# EAGLE design Armature_Joint_PCB_V1.1 (EAGLE 9.6.2)

## Sheet 1 of 3
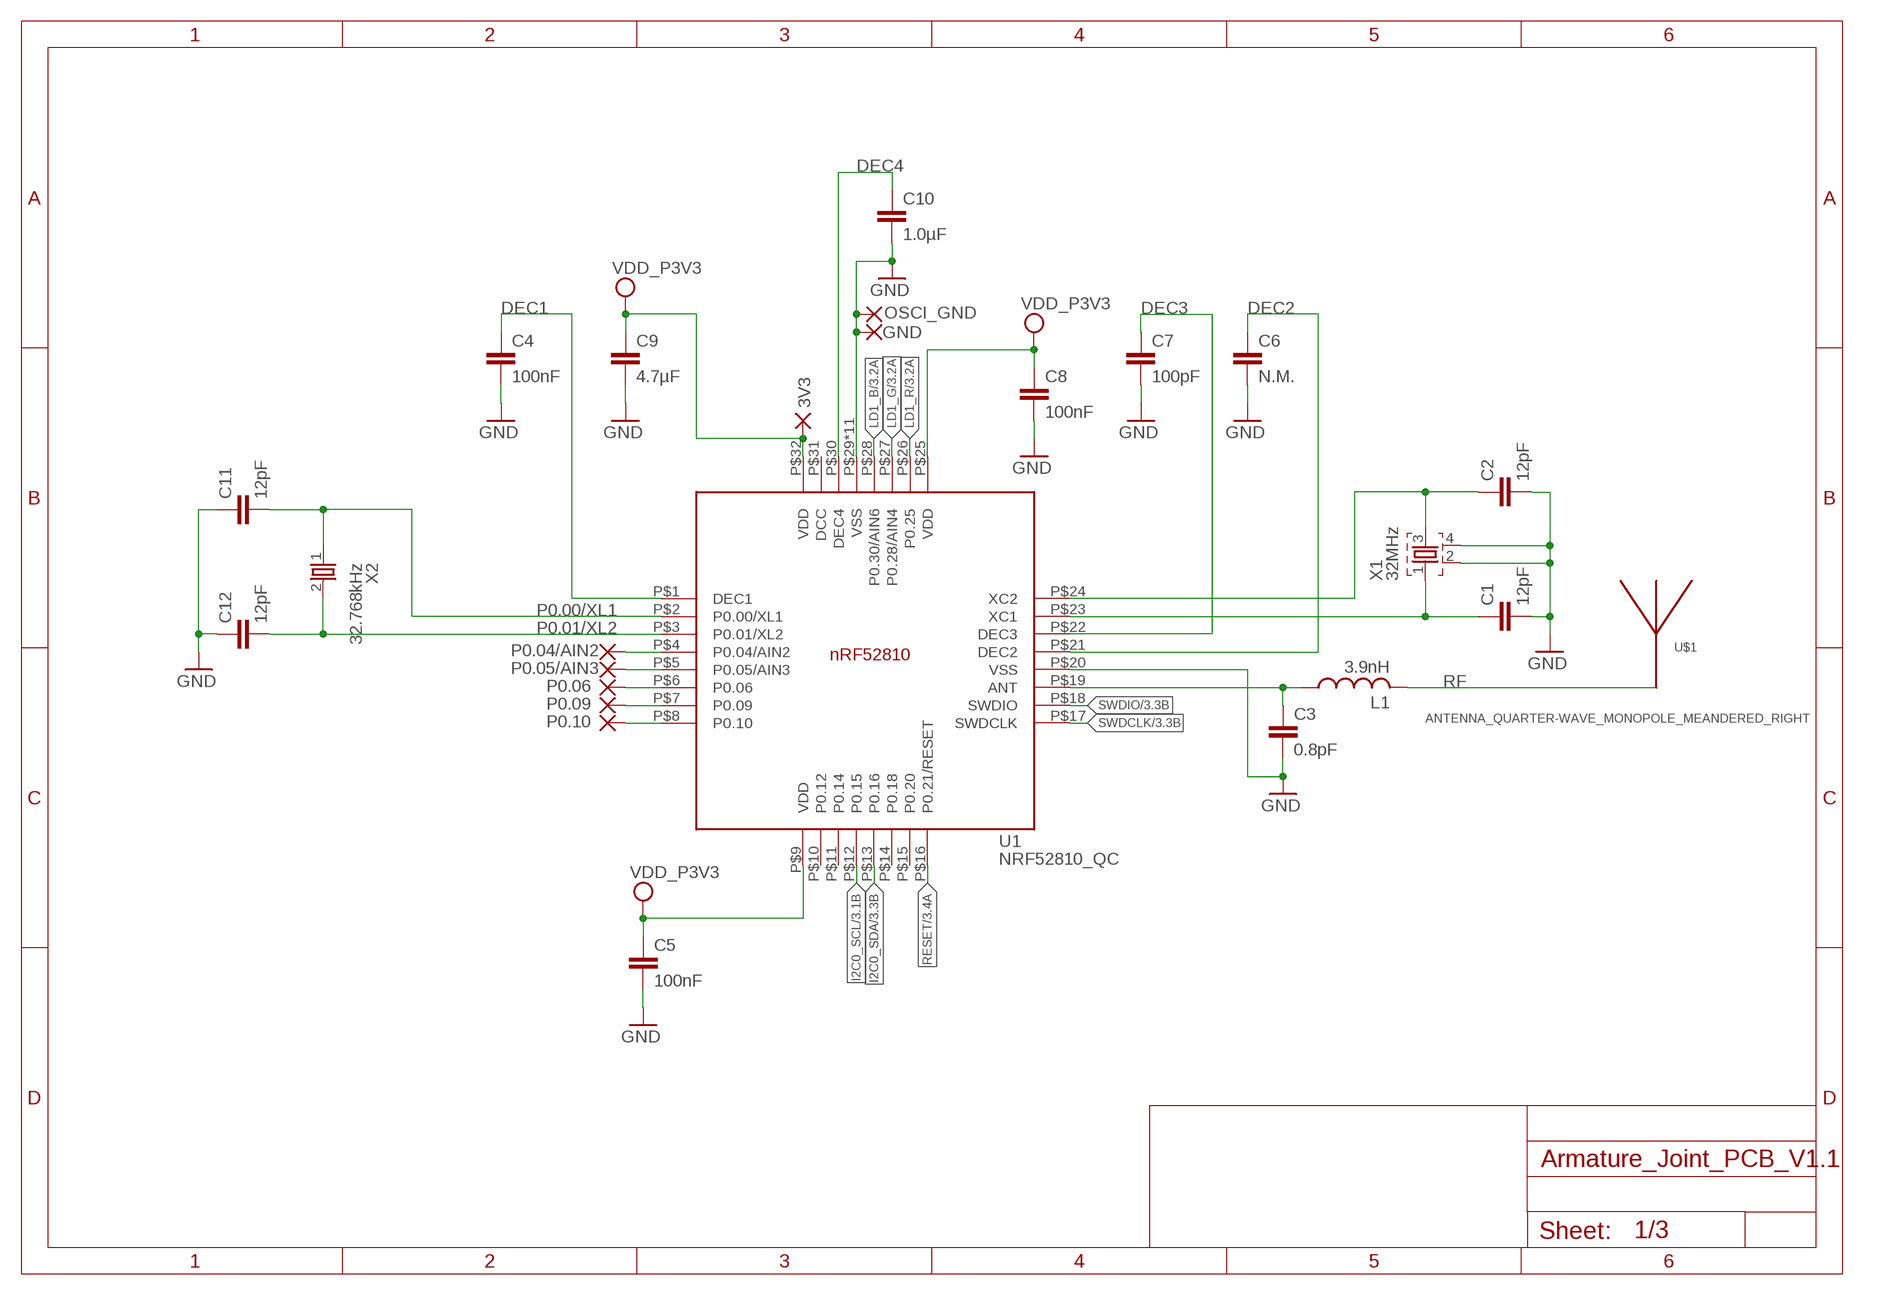
[diagram p0: schematic, sheet 1]

### Parts
3V3  vdd_p3v3  SMD2  [SMD1,27-2,54]
C1  12pF  CAPACITOR  [RESC0402_N]
C2  12pF  CAPACITOR  [RESC0402_N]
C3  0.8pF  CAPACITOR  [RESC0402_N]
C4  100nF  CAPACITOR  [RESC0402_N]
C5  100nF  CAPACITOR  [RESC0402_N]
C6  N.M.  CAPACITOR  [RESC0402_N]
C7  100pF  CAPACITOR  [RESC0402_N]
C8  100nF  CAPACITOR  [RESC0402_N]
C9  4.7µF  CAPACITORCAP_0603_N  [RESC0603_N]
C10  1.0µF  CAPACITORCAP_0603_N  [RESC0603_N]
C11  12pF  CAPACITOR  [RESC0402_N]
C12  12pF  CAPACITOR  [RESC0402_N]
GND  GND  SMD2  [SMD1,27-2,54]
L1  3.9nH  INDUCTOR_0402_N  [RESC0402_N]
OSCI_GND  GND  2,15/1,0  [2,15/1,0]
P0.04/AIN2  P0.04/AIN2  SMD2  [SMD1,27-2,54]
P0.05/AIN3  P0.05/AIN3  SMD2  [SMD1,27-2,54]
P0.06  P0.06  SMD2  [SMD1,27-2,54]
P0.09  P0.09  SMD2  [SMD1,27-2,54]
P0.10  P0.10  SMD2  [SMD1,27-2,54]
U1  NRF52810_QC  [QFN50P500X500X90-32_N]
U$1  ANTENNA_QUARTER-WAVE_MONOPOLE_MEANDERED_RIGHT  [QWMP_MEANDERED_RIGHT_+6]
X1  32MHz  XTAL_32MHZ  [BT-XTAL_2016_N]
X2  32.768kHz  XTAL_32KHZ  [XTAL_3215_N]

### Nets
ANT: C3.1 L1.1 U1.P$19(ANT)
DEC1: C4.1 U1.P$1(DEC1)
DEC2: C6.1 U1.P$21(DEC2)
DEC3: C7.1 U1.P$22(DEC3)
DEC4: C10.1 U1.P$30(DEC4)
GND: C1.2 C2.2 C3.2 C4.2 C5.2 C6.2 C7.2 C8.2 C9.2 C10.2 C11.1 C12.1 GND.1(P) OSCI_GND.1(P) U1.P$20(VSS) U1.P$29(VSS) U1.P$33(VSS) U1.P$34(VSS) U1.P$35(VSS) U1.P$36(VSS) U1.P$37(VSS) U1.P$38(VSS) U1.P$39(VSS) U1.P$40(VSS) U1.P$41(VSS) U1.P$42(VSS) X1.2 X1.4 ; also sheet 2,3
I2C0_SCL: U1.P$12(P0.15) ; also sheet 3
I2C0_SDA: U1.P$13(P0.16) ; also sheet 3
LD1_B [Signal]: U1.P$28(P0.30/AIN6) ; also sheet 3
LD1_G [Signal]: U1.P$27(P0.28/AIN4) ; also sheet 3
LD1_R [Signal]: U1.P$26(P0.25) ; also sheet 3
N$2: C2.1 U1.P$24(XC2) X1.3
P0.00/XL1: C11.2 U1.P$2(P0.00/XL1) X2.1
P0.01/XL2: C12.2 U1.P$3(P0.01/XL2) X2.2
P0.04/AIN2: P0.04/AIN2.1(P) U1.P$4(P0.04/AIN2)
P0.05/AIN3: P0.05/AIN3.1(P) U1.P$5(P0.05/AIN3)
P0.06: P0.06.1(P) U1.P$6(P0.06)
P0.09: P0.09.1(P) U1.P$7(P0.09)
P0.10: P0.10.1(P) U1.P$8(P0.10)
RESET: U1.P$16(P0.21/RESET) ; also sheet 3
RF: L1.2 U$1.P$1
SWDCLK: U1.P$17(SWDCLK) ; also sheet 3
SWDIO [Signal]: U1.P$18(SWDIO) ; also sheet 3
VDD_P3V3: 3V3.1(P) C5.1 C8.1 C9.1 U1.P$9(VDD) U1.P$25(VDD) U1.P$32(VDD) ; also sheet 2,3
X1: C1.1 U1.P$23(XC1) X1.1
Unconnected: U1.P$10(P0.12) U1.P$11(P0.14) U1.P$14(P0.18) U1.P$15(P0.20) U1.P$31(DCC)

## Sheet 2 of 3
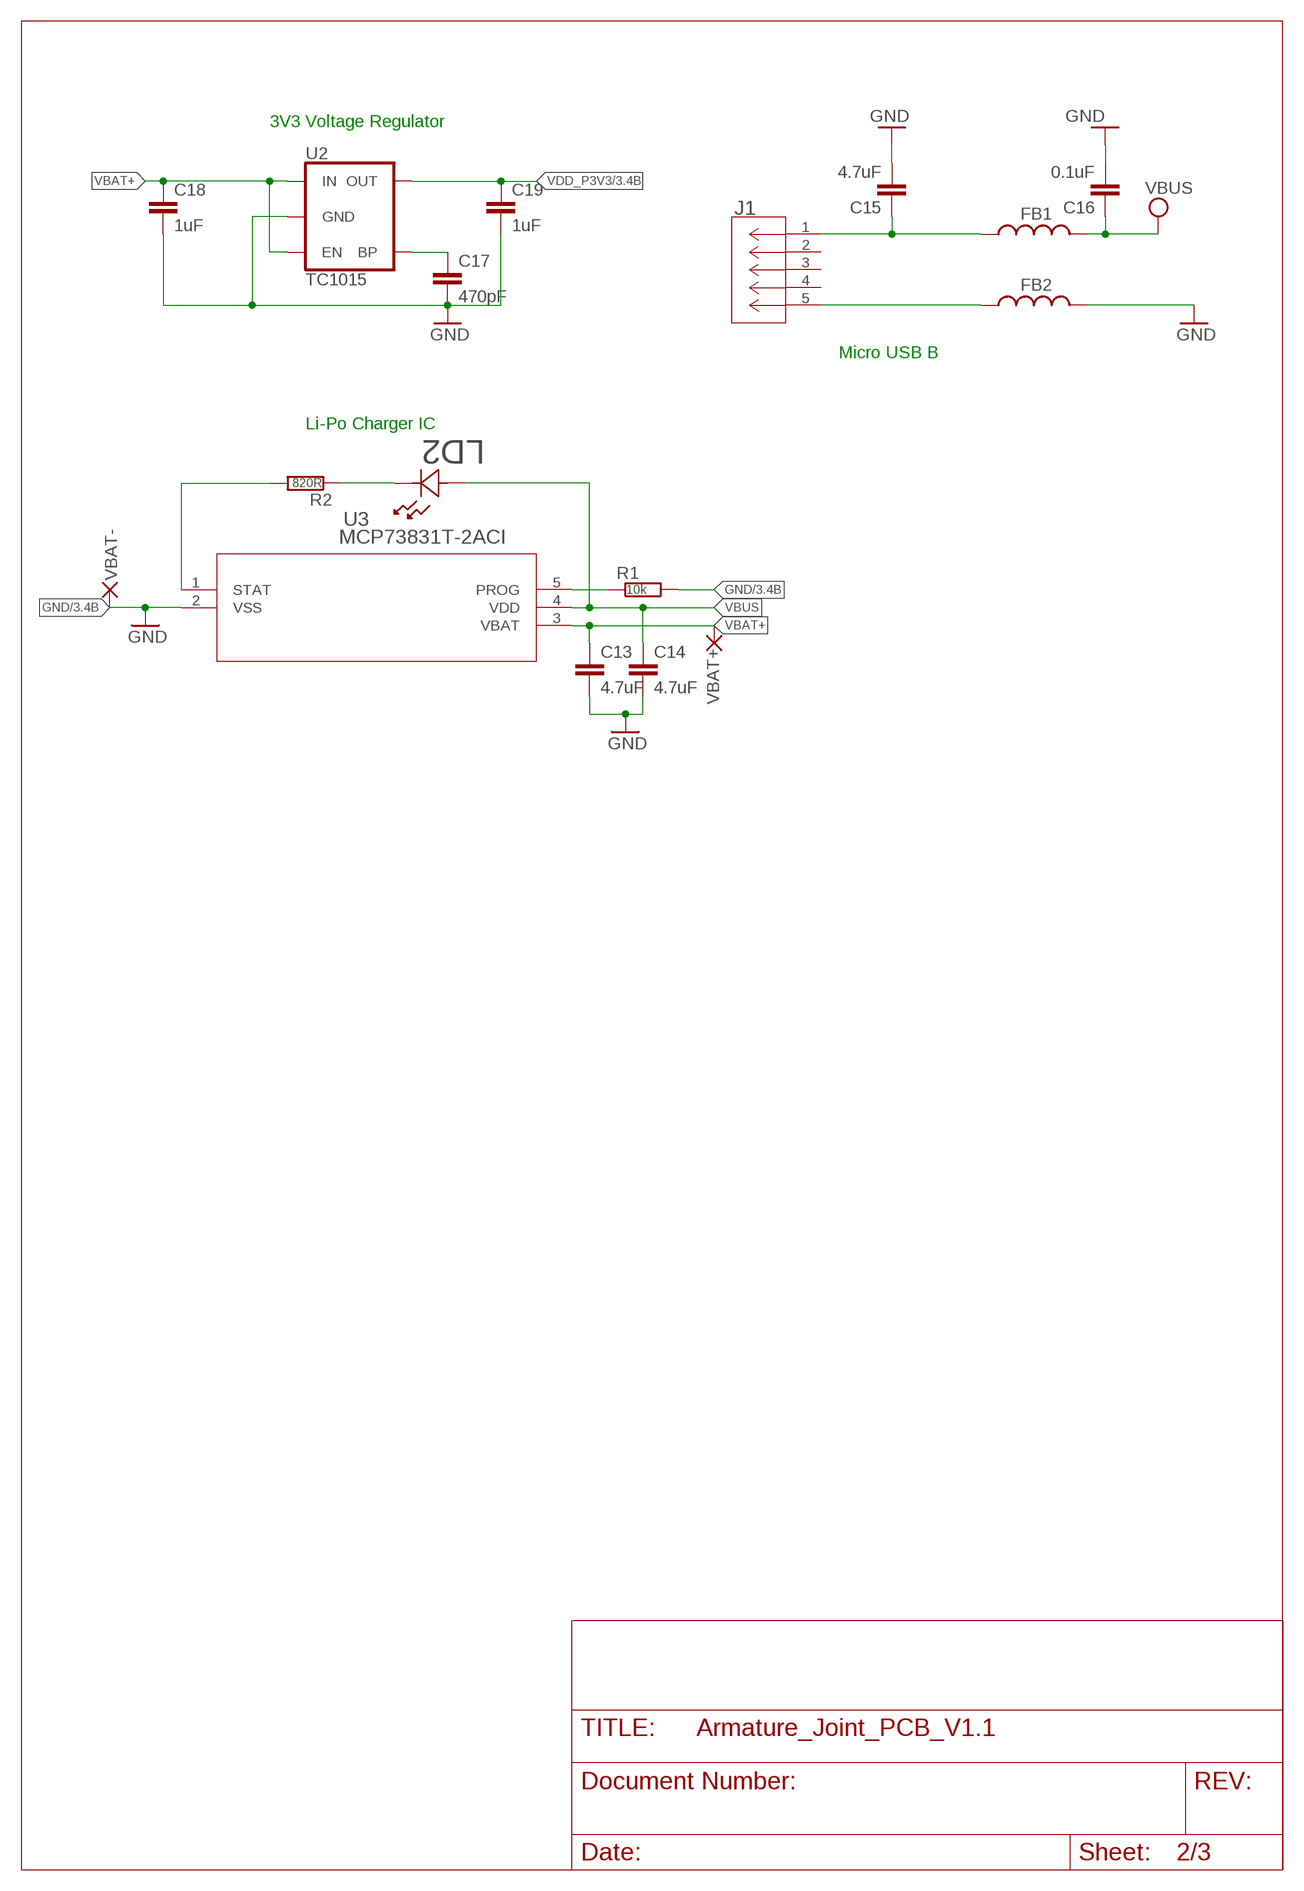
[diagram p1: schematic, sheet 2]

### Parts
C13  4.7uF  CAPACITORCAP_0603_N  [RESC0603_N]
C14  4.7uF  CAPACITORCAP_0603_N  [RESC0603_N]
C15  4.7uF  CAPACITORCAP_0603_N  [RESC0603_N]
C16  0.1uF  CAPACITORCAP_0603_N  [RESC0603_N]
C17  470pF  CAPACITOR  [RESC0402_N]
C18  1uF  CAPACITORCAP_0603_N  [RESC0603_N]
C19  1uF  CAPACITORCAP_0603_N  [RESC0603_N]
FB1  FERRITE_BEAD  [RESC0402_M]
FB2  FERRITE_BEAD  [RESC0402_M]
J1  10118192-0002LF  [CONN_10118192-0002LF_AMP]
LD2  LBQH9G-N1OO-35-1  [LED_SML-LX0402SYC-TR_LUM-M]
R1  10k  RESISTOR_0402_N  [RESC0402_N]
R2  820R  RESISTOR_0402_N  [RESC0402_N]
U2  TC1015  [SOT23-5]
U3  MCP73831T-2ACI  MCP73831T-2ACI/OT  [SOT-23-5_MC_MCH]
VBAT+  VBAT+  SMD2  [SMD1,27-2,54]
VBAT-  GND  SMD2  [SMD1,27-2,54]

### Nets
GND: C13.2 C14.2 C15.2 C16.2 C17.2 C18.2 C19.2 FB2.2 R1.2 U2.2(GND) U3.2(VSS) VBAT-.1(P) ; also sheet 1,3
N$1: LD2.1 R2.1
N$3: C17.1 U2.4(BP)
N$5: R1.1 U3.5(PROG)
N$8: R2.2 U3.1(STAT)
N$14: C15.1 FB1.1 J1.1
N$15: FB2.1 J1.5
VBAT+: C13.1 C18.1 U2.1(IN) U2.3(EN) U3.3(VBAT) VBAT+.1(P)
VBUS: C14.1 C16.1 FB1.2 LD2.2 U3.4(VDD)
VDD_P3V3: C19.1 U2.5(OUT) ; also sheet 1,3
Unconnected: J1.2 J1.3 J1.4

### Notes on the sheet
- 3V3 Voltage Regulator
- Micro USB B
- Li-Po Charger IC

## Sheet 3 of 3
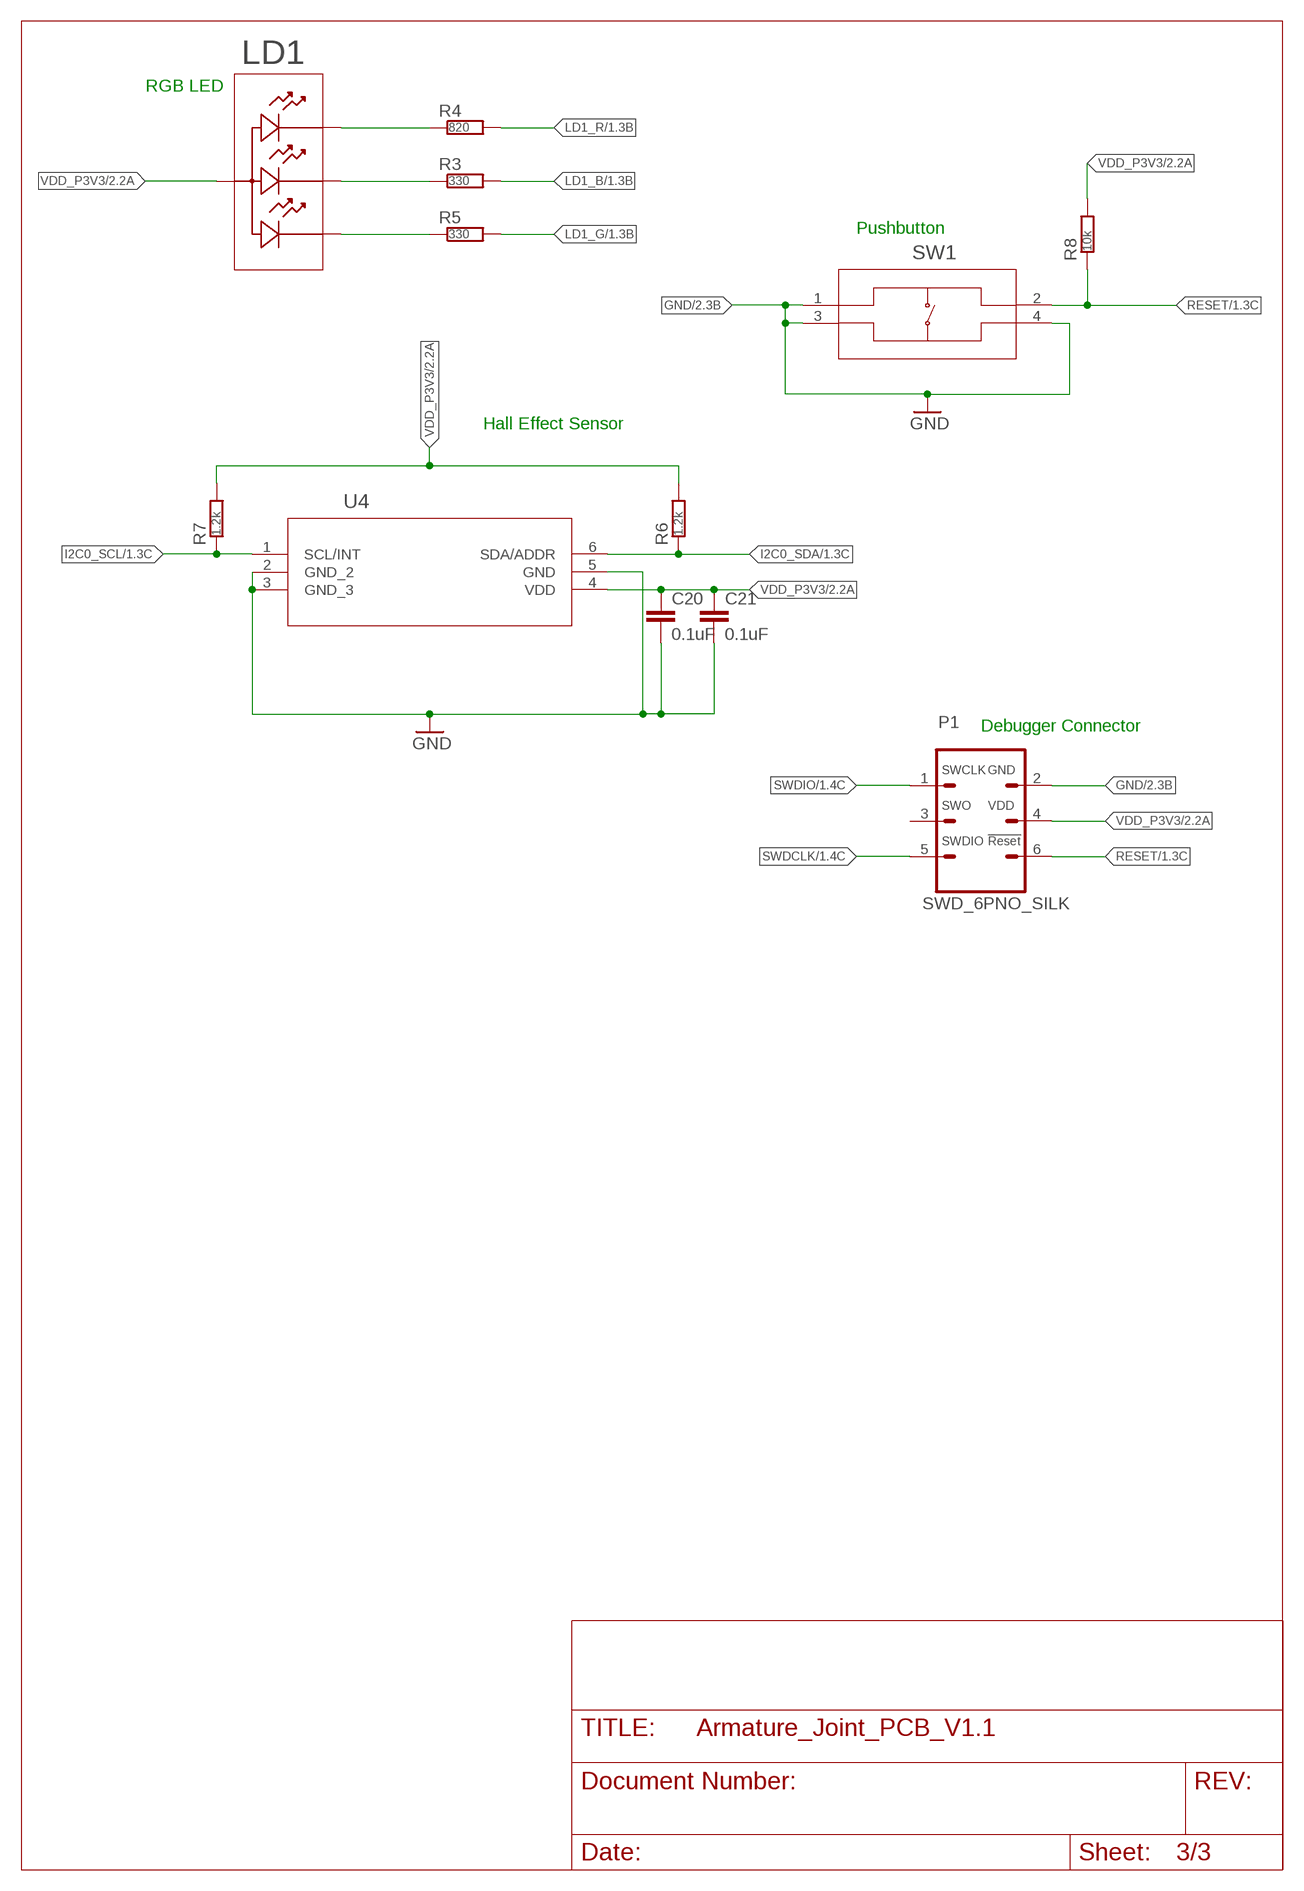
[diagram p2: schematic, sheet 3]

### Parts
C20  0.1uF  CAPACITOR_0402_M  [RESC0402_M]
C21  0.1uF  CAPACITOR_0402_M  [RESC0402_M]
LD1  APHF1608SEEQBDZGKCAPHF1608SEEQBDZGKC_KNB-L  [APHF1608SEEQBDZGKC_KNB-L]
P1  SWD_6PNO_SILK  [SWD_6P]
R3  330  RESISTOR_0402_N  [RESC0402_N]
R4  820  RESISTOR_0402_N  [RESC0402_N]
R5  330  RESISTOR_0402_N  [RESC0402_N]
R6  1.2k  RESISTOR_0402_N  [RESC0402_N]
R7  1.2k  RESISTOR_0402_N  [RESC0402_N]
R8  10k  RESISTOR_0402_N  [RESC0402_N]
SW1  PTS810SJG250SMTRLFS  [PTS810]
U4  TLV493DA1B6HTSA2  [PG-TSOP6-6-5_INF]

### Nets
GND: C20.2 C21.2 P1.2 SW1.1 SW1.3 SW1.4 U4.2(GND_2) U4.3(GND_3) U4.5(GND) ; also sheet 1,2
I2C0_SCL: R7.1 U4.1(SCL/INT) ; also sheet 1
I2C0_SDA: R6.1 U4.6(SDA/ADDR) ; also sheet 1
LD1_B [Signal]: R3.2 ; also sheet 1
LD1_G [Signal]: R5.2 ; also sheet 1
LD1_R [Signal]: R4.2 ; also sheet 1
N$9: LD1.4 R5.1
N$10: LD1.3 R3.1
N$11: LD1.2 R4.1
RESET: P1.6 R8.1 SW1.2 ; also sheet 1
SWDCLK: P1.5 ; also sheet 1
SWDIO [Signal]: P1.1 ; also sheet 1
VDD_P3V3: C20.1 C21.1 LD1.1 P1.4 R6.2 R7.2 R8.2 U4.4(VDD) ; also sheet 1,2
Unconnected: P1.3

### Notes on the sheet
- RGB LED
- Pushbutton
- Hall Effect Sensor
- Debugger Connector

## Library data of the parts
3V3 GND P0.04/AIN2 P0.05/AIN3 P0.06 P0.09 P0.10 VBAT+ VBAT- = Armature_joint:SMD2: SMD PAD
C1-C21 = Armature_joint:CAPACITOR: Generic chip capacitor
FB1 FB2 = Armature_joint:FERRITE_BEAD
J1 = Armature_joint:10118192-0002LF; BUILT_BY: EMA_Cory; COPYRIGHT: Copyright (C) 2018 Accelerated Designs. All rights reserved; DATASHEET: https://www.amphenol-icc.com/media/wysiwyg/files/drawing/10118192.pdf; MANUFACTURER_PART_NUMBER: 10118192-0002LF; SOURCELIBRARY: Amphenol_ICC_2020-05-19; VENDOR: Amphenol
L1 = Armature_joint:INDUCTOR: Generic chip inductor
LD1 = Armature_joint:APHF1608SEEQBDZGKC; BUILT_BY: EMA_Cory; COPYRIGHT: Copyright (C) 2018 Accelerated Designs. All rights reserved; DATASHEET: http://www.kingbrightusa.com/images/catalog/SPEC/APHF1608SEEQBDZGKC.pdf; MANUFACTURER_PART_NUMBER: APHF1608SEEQBDZGKC; SOURCELIBRARY: Kingbright_2020-03-06; VENDOR: Kingbright
LD2 = Armature_joint:LBQH9G-N1OO-35-1
OSCI_GND = Armature_joint:2,15/1,0: THROUGH-HOLE PAD
P1 = Armature_joint:SWD_6P: Multi connection point. Often used as Generic Header-pin footprint for 0.1 inch spaced/style header connections You can populate with any combo of single row headers, but if you'd like an exact match, check these: Header - 2x3 (Male, 0.1") <https://www.sparkfun.com/products/12807> (PRT-12807) Header - 2x3 (Female, 0.1") <https://www.sparkfun.com/products/13010> (PRT-13010) 2x3 Pin Shrouded Header <https://www.sparkfun.com/products/10877> (PRT-10877) On any of the 0.1 inch spaced packages, you can populate with these: Break Away Headers - Straight <https://www.sparkfun.com/products/116> (PRT-00116) Break Away Male Headers - Right Angle <https://www.sparkfun.com/products/553> (PRT-00553) Female Headers <https://www.sparkfun.com/products/115> (PRT-00115) Break Away Headers - Machine Pin <https://www.sparkfun.com/products/117> (PRT-00117) Break Away Female Headers - Swiss Machine Pin <https://www.sparkfun.com/products/743> (PRT-00743) Special note: the shrouded connector mates well with our 3x2 ribbon cables: Ribbon Crimp Connector - 6-pin (2x3, Female) <https://www.sparkfun.com/products/10651> (PRT-10651) Ribbon Cable - 6 wire (15ft) <https://www.sparkfun.com/products/10646> (PRT-10646)
R1-R8 = Armature_joint:RESISTOR_0402_N
SW1 = Armature_joint:PTS810SJG250SMTRLFS; BUILT_BY: EMA_Cory; COPYRIGHT: Copyright (C) 2018 Accelerated Designs. All rights reserved; DATASHEET: https://www.ckswitches.com/products/tactile/PTS810/#PTS810SJG250SMTRLFS; MANUFACTURER_PART_NUMBER: PTS810SJG250SMTRLFS; SOURCELIBRARY: C&K_2020-03-31; VENDOR: C&K
U1 = Armature_joint:NRF52810_QC: nRF52810 Features Single chip, highly flexible, 2.4 GHz multi-protocol SoC 32-bit ARM Cortex-M4 Processor 1.7v to 3.6v operation 192kB flash + 24kB RAM Supports concurrent Bluetooth low energy/ANT protocol operation Up to +4dBm output power -96dBm sensitivity, Bluetooth low energy Thread safe and run-time protected Event driven API On air compatible with nRF24L and nRF24AP series 2 data rates (2Mbps/1Mbps) PPI - maximum flexibility for power-efficient applications and code simplification Automated power management system with automatic power management of each peripheral Configurable I/O mapping for analog and digital I/O 1 x Master/Slave SPI 1 x Two-wire interface (I²C) UART (RTS/CTS) 1 x PWM (4 channels) AES HW encryption 8-channel 10/12-bit ADC Quadrature decoder 64-level analog comparator Real Time Counter (RTC) Digital microphone interface (PDM) On-chip balun Applications Bluetooth 5 connectivity processor Industrial sensors and actuators Wearables SmartHome sensors computer peripherals RF smart remotes Airfuel (A4WP) wireless charging Beacons Sports and fitness sensors Connected health products Smart watches RC Toys Interactive games Building automation
U2 = Armature_joint:TC1015
U3 = Armature_joint:MCP73831T-2ACI/OT; BUILT_BY: EMA_UL_Team; DATASHEET: http://www.microchip.com/mymicrochip/filehandler.aspx?ddocname=en025112; MANUFACTURER_PART_NUMBER: MCP73831T-2ACI/OT; SOURCELIBRARY: Microchip_2011-05-13; VENDOR: Microchip
U4 = Armature_joint:TLV493DA1B6HTSA2; BUILT_BY: EMA_Justin; COPYRIGHT: Copyright (C) 2018 Accelerated Designs. All rights reserved; MANUFACTURER_PART_NUMBER: TLV493DA1B6HTSA2; SOURCELIBRARY: Infineon_2020-05-11; VENDOR: Infineon
U$1 = Armature_joint:ANTENNA_QUARTER-WAVE_MONOPOLE_MEANDERED_RIGHT
X1 = Armature_joint:XTAL_32MHZ
X2 = Armature_joint:XTAL_32KHZ

## Net classes
1 Signal: width 0.15 mm, drill 0.15 mm, clearance 0.15 mm
2 Decouple: width 0.2 mm, clearance 0.2 mm

## Board
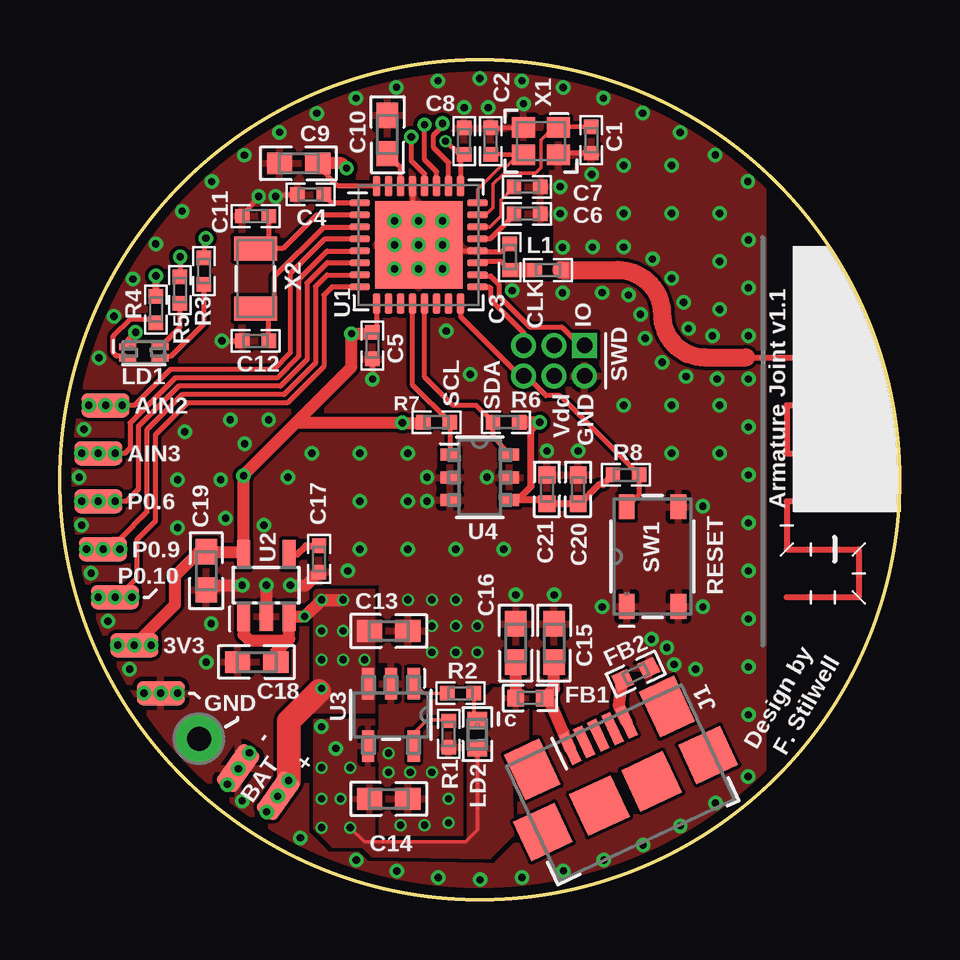
[diagram p3: board, top side]
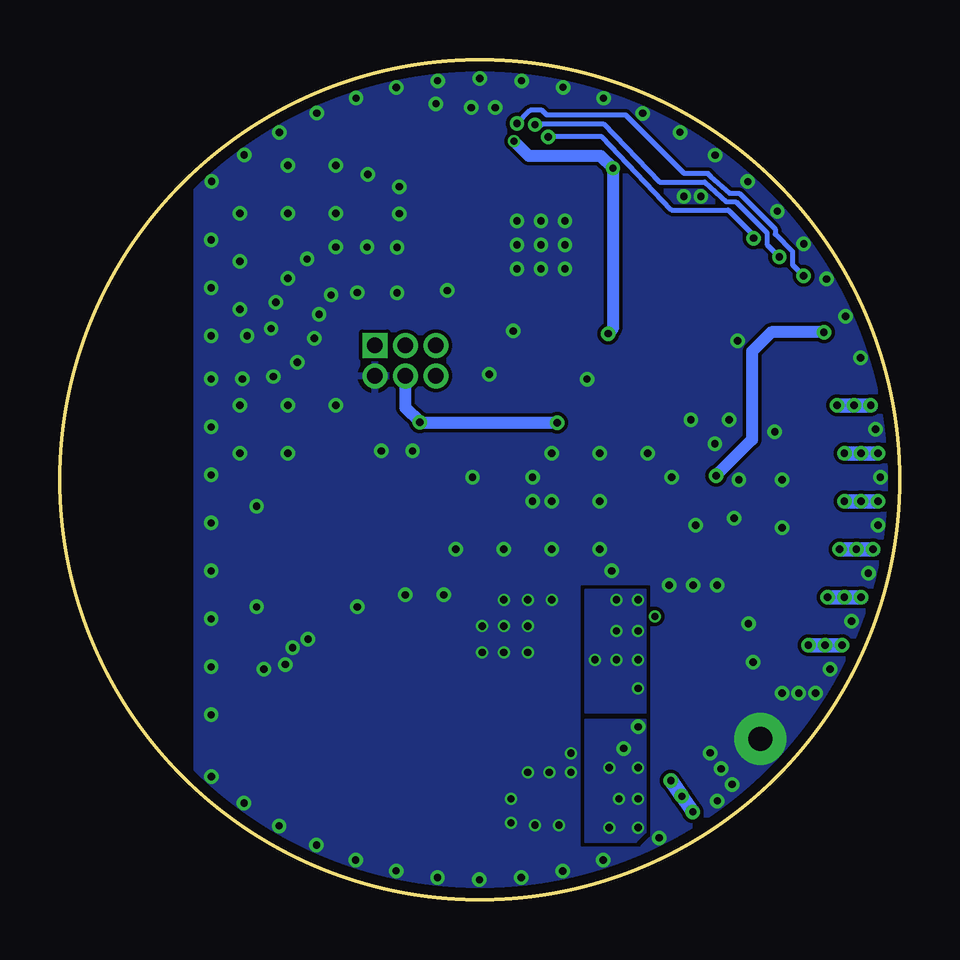
[diagram p4: board, bottom side, seen from below]

Size 35 x 35 mm. Coordinates in mm from the lower left corner, seen from the top.
Outline: circle at 17.5,17.5 radius 17.5
Copper layers (1*16): Top 0.035mm / dielectric 1.5mm / Bottom 0.035mm
Design rules "PCBZone *": minimum track width 0.15mm, minimum drill 0.25mm, track to track 0.15mm, track to pad 0.15mm, pad to pad 0.15mm, via to via 0.15mm, smd to smd 0mil, copper to edge 0.4mm, drill to drill 0.4mm, minimum pad ring 0.1mm, minimum via ring 0.1mm, stop-mask expansion 4mil, vias tented up to drill 0.6mm, thermal gap 0.2mm
tRestrict: area 17.8,25.8 to 20.5,28.1

### Footprints (pad centres in the part's own frame; a part is rotated, then mirrored left to right if it is on the bottom)
SMD1,27-2,54 = smd 1 x 2: 1 0,0
RESC0402_N = smd 0.6 x 0.6: 1 -0.55,0; 2 0.55,0
RESC0603_N = smd 1.05 x 0.9: 1 -0.8,0; 2 0.8,0
RESC0402_M = smd 0.7 x 0.7: 1 -0.6,0; 2 0.6,0
CONN_10118192-0002LF_AMP = smd 0.406 x 1.346: 1 -1.3,2.204; 2 -0.65,2.204; 3 0,2.204; 4 0.65,2.204; 5 1.3,2.204 | smd 1.6 x 2.108: 6 -3.1,2.079; 7 3.1,2.079 | smd 1.905 x 1.803: 8 -3.8,-0.471; 9 3.8,-0.471 | smd 1.905 x 1.905: 10 -1.2,-0.471; 11 1.2,-0.471
APHF1608SEEQBDZGKC_KNB-L = smd 0.711 x 0.279: 1 -0.673,0.237; 2 -0.673,-0.237; 3 0.673,-0.237; 4 0.673,0.237
LED_SML-LX0402SYC-TR_LUM-M = smd 0.66 x 0.813: 1 -0.597,0; 2 0.597,0
2,15/1,0 = drill 1.016 pad 2.159: 1 0,0
SWD_6P = drill 0.65 pad 1 square: 1 -1.27,0 | drill 0.65 pad 1: 2 -1.27,1.27; 3 0,0; 4 0,1.27; 5 1.27,0; 6 1.27,1.27
PTS810 = smd 1.041 x 0.66: 1 -2.075,1.075; 2 2.075,1.075; 3 -2.075,-1.075; 4 2.075,-1.075
QFN50P500X500X90-32_N = smd 0.85 x 0.3: P$1 -2.45,1.75; P$2 -2.45,1.25; P$3 -2.45,0.75; P$4 -2.45,0.25; P$5 -2.45,-0.25; P$6 -2.45,-0.75; P$7 -2.45,-1.25; P$8 -2.45,-1.75; P$17 2.45,-1.75; P$18 2.45,-1.25; P$19 2.45,-0.75; P$20 2.45,-0.25; P$21 2.45,0.25; P$22 2.45,0.75; P$23 2.45,1.25; P$24 2.45,1.75 | smd 0.3 x 0.85: P$9 -1.75,-2.45; P$10 -1.25,-2.45; P$11 -0.75,-2.45; P$12 -0.25,-2.45; P$13 0.25,-2.45; P$14 0.75,-2.45; P$15 1.25,-2.45; P$16 1.75,-2.45; P$25 1.75,2.45; P$26 1.25,2.45; P$27 0.75,2.45; P$28 0.25,2.45; P$29 -0.25,2.45; P$30 -0.75,2.45; P$31 -1.25,2.45; P$32 -1.75,2.45 | smd 3.65 x 3.65: P$33 0,0 | drill 0.3 pad 0.6: P$34 -1,1; P$35 0,1; P$36 1,1; P$37 -1,0; P$38 0,0; P$39 1,0; P$40 -1,-1; P$41 0,-1; P$42 1,-1
SOT23-5 = smd 0.55 x 1.2: 1 -0.95,-1.3; 2 0,-1.3; 3 0.95,-1.3; 4 0.95,1.3; 5 -0.95,1.3
SOT-23-5_MC_MCH = smd 1.31 x 0.508: 1 -1.295,0.95; 2 -1.295,0; 3 -1.295,-0.95; 4 1.295,-0.95; 5 1.295,0.95
PG-TSOP6-6-5_INF = smd 0.794 x 0.507: 1 -1.248,0.95; 2 -1.248,0; 3 -1.248,-0.95; 4 1.248,-0.95; 5 1.248,0; 6 1.248,0.95
QWMP_MEANDERED_RIGHT_+6 = smd 0.254 x 0.254: P$1 0,0
BT-XTAL_2016_N = smd 0.95 x 0.85: 1 -0.725,-0.575; 2 0.725,-0.575; 3 0.725,0.575; 4 -0.725,0.575
XTAL_3215_N = smd 1 x 1.8: 1 -1.25,0; 2 1.25,0

### Placement (x,y rotation side)
3V3  3.1,10.6 270 top
C1  22.15,31.66 270 top
C2  17.95,31.62 90 top
C3  18.75,26.79 90 top
C4  10.45,29.39 180 top
C5  13.03,23.09 270 top
C6  19.48,28.59 0 top
C7  19.48,29.72 0 top
C8  16.85,31.62 90 top
C9  9.95,30.69 180 top
C10  13.65,31.89 90 top
C11  8.15,28.49 0 top
C12  8.15,23.29 0 top
C13  13.7,11.2 0 top
C14  13.7,4.2 0 top
C15  20.6,10.7 90 top
C16  19,10.7 90 top
C17  10.8,14.2 270 top
C18  8.2,9.9 180 top
C19  6.1,13.7 270 top
C20  21.6,17.1 90 top
C21  20.3,17.1 90 top
FB1  19.6,8.4 180 top
FB2  24,9.4 25 top
GND  4.2,8.6 270 top
J1  23.38,4.85 25 top
L1  20.35,26.24 0 top
LD1  3.5,22.8 0 top
LD2  17.4,6.9 270 top
OSCI_GND  5.8,6.7 0 top
P0.04/AIN2  1.9,20.6 270 top
P0.05/AIN3  1.6,18.6 270 top
P0.06  1.6,16.6 270 top
P0.09  1.8,14.6 270 top
P0.10  2.3,12.6 270 top
P1  20.6,23.1 180 top
R1  16.2,6.9 270 top
R2  16.7,8.6 180 top
R3  6,26.2 90 top
R4  4,24.6 90 top
R5  5,25.4 90 top
R6  18.6,19.9 0 top
R7  15.7,19.9 180 top
R8  23.6,17.7 180 top
SW1  24.7,14.3 90 top
U1  14.95,27.29 0 top
U2  8.6,13.1 0 top
U3  13.8,7.7 270 top
U4  17.5,17.6 0 top
U$1  29.3,22.6 0 top
VBAT+  9.1,4.32 325 top
VBAT-  7.43,5.48 325 top
X1  20.05,31.62 180 top
X2  8.15,25.89 270 top

### Tracks (layer width: path | path; a pad name or v marks a point on that pad's centre or on a via)
ANT
  Top 0.152: 17.45,26.59 U1.P$19
  Top 0.2: 18.8,26.24 C3.1 18.4,26.59 17.45,26.59
  Top 0.6: L1.1 18.8,26.24
DEC1
  Top 0.2: U1.P$1 11.35,29.04 C4.1
DEC2
  Top 0.2: C6.1 18.93,28.54 17.93,27.54 U1.P$21
DEC3
  Top 0.15: U1.P$22 17.93,28.04 18.38,28.49 18.38,29.17 C7.1
DEC4
  Top 0.2: U1.P$30 14.2,30.54 C10.1
GND  (via drill 0.3, 0.3 pad 0.6)
  Top 0.152: 17.45,26.99 U1.P$20
  Top 0.2: C3.2 18.4,26.99 17.45,26.99 | C1.2 20.85,31.12 X1.4 | C2.2 19.3,32.22 X1.2 | U1.P$29 14.7,28.29 U1.P$35 | U1.P$20 16.2,27.04 arc-90 U1.P$39 | C5.2 v13.03,21.7 | v6.75,23.29 C12.1 | v8.99,29.31 9.17,29.39 C4.2 | v8.28,29.31 7.6,28.53 C11.1
  Top 0.3: C19.2 6.3,13.1
  Top 0.5: 6.3,13.1 v7.6,13.1 | v9.6,13.1 10.25,13.1 C17.2 | v8.6,13.1 U2.2
  other vias: 15.3,16.6 21.6,18.7 20.3,18.7 14.6,5.3 14.2,3.1 15.5,10.3 16.5,10.3 17.4,10.3 15.5,11.4 17.4,11.4 15.5,12.5 14.5,12.5 16.5,12.5 16.5,11.4 15.2,3.1 16.2,3.2 16.2,4.2 15.5,5.3 16.85,33.02 20.85,29.72 20.85,28.59 22.17,30.23 19.33,33.17 17.85,33.02 20.95,25.29 20.95,27.19 18.85,25.39 22.6,25.3 23.7,25.2 24.2,24.4 24.4,23.4 25.1,22.4 26.1,21.8 27.4,21.7 27.2,23.5 26.2,23.8 26,24.9 25.5,25.9 24.7,26.7 23.5,27.2 22.2,27.2 15.3,17.6 6.98,4.8 7.9,6.11 7.44,5.45 6.1,9.9 4.2,8.6 4.9,8.6 3.5,8.6 6.3,11.5 19,12.7 20.6,12.7 17.5,34.23 19.26,34.13 20.98,33.85 22.66,33.41 24.29,32.78 25.86,31.98 27.32,31.04 28.68,29.94 28.69,5.12 27.33,4.02 25.86,3.07 24.31,2.27 22.67,1.65 20.99,1.19 19.26,0.92 17.51,0.83 15.77,0.92 14.04,1.19 12.35,1.64 10.02,2.57 7.6,4.11 1.62,22.58 2.25,24.31 3.04,25.87 3.99,27.34 5.09,28.69 6.33,29.93 7.69,31.03 9.15,31.98 10.71,32.78 12.34,33.41 14.03,33.86 15.75,34.13 24.66,10.85 26.8,12.2 22.6,12.2 26.8,16.4 28.7,21.7 28.7,19.7 28.7,17.7 28.7,15.7 28.7,13.7 28.7,11.7 28.7,9.7 28.7,7.7 28.7,23.5 28.7,25.5 28.7,27.5 6.7,17.5 6.9,15.9 5.2,19.5 4.9,17.5 4.9,15.5 7.1,20 8.7,20 7.7,19 17.8,17.6 2,11.6 2.9,9.6 1.3,13.6 0.9,15.6 0.8,17.6 1,19.6 13.7,5.3 13.7,6.1 12,13.7 8.5,15.6 10.5,18.6 12.5,18.6 14.5,18.6 12.5,16.6 14.5,16.6 12.5,14.6 14.5,14.6 16.5,14.6 9.5,17.6 18.5,14.6 26.5,9.6 25.5,20.6 25.5,18.6 27.5,18.6 27.5,20.6 23.5,20.6 27.5,24.6 27.5,26.6 27.5,28.6 25.5,28.6 23.5,28.6 23.5,30.6 25.5,30.6 25.3,10.5 25.6,9.8 16.1,23.7 17.1,21.9
  pour Top (rank 3): -3.7,-4.5 -3.6,-3.7 -3.7,38.3 29.3,38.3 29.3,-4.5
  pour Bottom (rank 3): -3.7,-3.7 -3.7,39 29.3,39 29.3,-3.7
  pour Top: 17.8,10 17.8,11.7 16.6,12.9 14,12.9 14,10.5 13.5,10.5 13.5,4.9 13.8,4.9 13.8,2.6 16.6,2.6 16.6,5.4 14.3,5.4 14.3,10
  pour Bottom (no thermals): 13.5,12.9 13.5,2.4 17.8,2.4 17.8,11.7 16.6,12.9
I2C0_SCL
  Top 0.2: U1.P$12 14.7,21.45 R7.1 U4.1
I2C0_SDA
  Top 0.2: U1.P$13 15.2,21.79 16.39,20.6 17.35,20.6 R6.1 18.05,19.35 U4.6
LD1_B  (via drill 0.3 pad 0.6)
  Top 0.2: U1.P$28 15.2,30.24 14.65,30.79 v14.65,31.79 | v6.08,27.57 6.01,27.5 6,27.5 R3.2
  Bottom 0.2: v6.08,27.57 6.03,27.57 6,27.6 7.14,28.74 9.5,28.74 12.4,31.79 v14.65,31.79
LD1_G  (via drill 0.3 pad 0.6)
  Top 0.2: U1.P$27 15.7,30.34 15.2,30.84 v15.2,32.3 | v5.01,26.79 R5.2
  Bottom 0.2: v15.2,32.3 14.92,32.3 14.88,32.34 12.35,32.34 10.01,29.91 8.12,29.91 7.21,29.09 6.82,29.09 5.53,27.8 5.53,27.31 v5.01,26.79
LD1_R  (via drill 0.3 pad 0.6)
  Top 0.2: U1.P$26 16.2,30.72 15.57,31.35 15.57,31.88 16,32.3 v15.95,32.35
  Top 0.3: R4.2 v4,26
  Bottom 0.2: v15.95,32.35 15.4,32.9 14.9,32.9 14.7,32.7 11.41,32.7 8.97,30.27 7.98,30.27 7.88,30.16 7.08,29.44 6.68,29.44 5.18,27.94 5.18,27.74 4.46,27.02 4.46,26.46 v4,26
N$1
  Top 0.152: R2.1 17.25,7.65 LD2.1
N$2
  Top 0.15: X1.3 19.1,31.04 18.65,30.59 18.4,30.59 17.4,29.59 U1.P$24
  Top 0.2: X1.3 19.3,31.02 C2.1
N$3
  Top 0.3: U2.4 9.9,14.4 10.25,14.75 C17.1
N$5
  Top 0.152: U3.5 14.75,6.95 15.3,7.5 16.15,7.5 R1.1
N$8
  Top 0.152: U3.1 15.2,8.6 R2.2
N$9
  Top 0.2: LD1.4 5,23.86 R5.1
N$10
  Top 0.2: LD1.3 4.26,22.65 4.63,22.65 6,24.02 R3.1
N$11
  Top 0.2: LD1.2 2.74,22.65 2.37,22.65 2.22,22.79 2.22,23.5 2.92,24.2 3.85,24.2 R4.1
N$14
  Top 0.5: C15.1 20.6,8.8 FB1.1 20.3,8.3 20.4,8.3 21,6.95 J1.1
N$15
  Top 0.5: J1.5 23.3,8.1 FB2.1
P0.00/XL1
  Top 0.2: U1.P$2 10.7,28.54 9.3,27.14 8.7,27.14 | 8.7,27.14 X2.1 | C11.2 8.7,27.14
P0.01/XL2
  Top 0.2: C12.2 8.7,24.64 X2.2 8.95,24.64 8.95,25.99 11,28.04 U1.P$3
P0.04/AIN2  (via drill 0.3 pad 0.6)
  Top 0.2: U1.P$4 11.04,27.54 9.6,26.1 9.6,22.8 8.9,22.1 4.6,22.1 3.1,20.6 P0.04/AIN2.1
  Bottom 0.6: v1.2,20.6 P0.04/AIN2.1 v2.6,20.6
  other vias: 1.9,20.6
P0.05/AIN3  (via drill 0.3 pad 0.6)
  Top 0.2: U1.P$5 11.14,27.04 9.95,25.85 9.95,22.66 9.04,21.75 4.8,21.75 2.92,19.87 2.92,18.82 2.7,18.6 P0.05/AIN3.1
  Bottom 0.6: v0.9,18.6 P0.05/AIN3.1 v2.3,18.6
  other vias: 1.6,18.6
P0.06  (via drill 0.3 pad 0.6)
  Top 0.2: U1.P$6 12.49,26.55 11.15,26.55 10.3,25.71 10.3,22.51 9.19,21.4 4.95,21.4 3.27,19.73 3.27,17.1 2.77,16.6 P0.06.1
  Bottom 0.6: v0.9,16.6 P0.06.1 v2.3,16.6
  other vias: 1.6,16.6
P0.09  (via drill 0.3 pad 0.6)
  Top 0.2: U1.P$7 11.13,26.04 10.65,25.56 10.65,22.37 9.34,21.05 5.09,21.05 3.62,19.58 3.62,16.15 2.49,15.02 2.21,15.02 P0.09.1
  Bottom 0.6: v1.1,14.6 P0.09.1 v2.5,14.6
  other vias: 1.8,14.6
P0.10  (via drill 0.3 pad 0.6)
  Top 0.2: U1.P$8 11.34,25.54 11,25.2 11,22.22 9.48,20.7 5.3,20.7 3.97,19.37 3.97,15.77 3.2,15 3.2,13.4 2.4,12.6 P0.10.1
  Bottom 0.6: v1.6,12.6 P0.10.1 v3,12.6
  other vias: 2.3,12.6
RESET
  Top 0.2: SW1.2 24.15,16.9 R8.1 20.84,21.01 20.26,21.01 19.44,21.83 P1.6 19.17,21.83 16.7,24.3 U1.P$16
RF
  Top 0.254: 28.6,22.6 U$1.P$1
  Top 0.75: L1.2 23.26,26.24 arc-90 25.1,24.4 arc90 26.9,22.6 28.6,22.6
SWDCLK
  Top 0.2: U1.P$17 17.91,25.54 17.95,25.5 17.95,25.02 19.33,23.64 P1.5
SWDIO
  Top 0.2: U1.P$18 arc90 17.45,25.99 17.95,25.99 18.3,25.64 18.3,25.16 19.59,23.87 20.92,23.87 21.69,23.1 P1.1
VBAT+  (via drill 0.3, 0.3 pad 0.6)
  Top 0.5: C18.1 9,10.31 9.49,10.8 | U2.3 9.56,10.87 9.49,10.8 | U2.3 | U2.3 v10.19,11.79 v10.2,11.8 v10.9,12.5 v11.8,12.5 | U2.1 7.65,11.05 7.9,10.8 9.49,10.8 | VBAT+.1 v9.08,4.31 | v10.9,8.8 10.9,8.68 10.78,8.68
  Top 1: v9.54,4.96 9.54,7.44 10.78,8.68
  Bottom 0.6: v8.62,3.65 v9.08,4.31 v9.54,4.96
  other vias: 11.8,10 10.9,10 11.8,11.2 10.9,11.2 12.7,10
  pour Top (rank 2, no thermals): 13.1,7.8 10.6,7.8 10.6,12.9 13.1,12.9
  pour Bottom (rank 2, no thermals): 13.1,7.8 10.6,7.8 10.6,12.9 13.1,12.9
VBUS  (via drill 0.3, 0.3 pad 0.6)
  Top 0.15: 13.6,2.4 12.7,2.4 v12.1,3
  Top 0.152: LD2.2 17.4,2.9 16.9,2.4 13.6,2.4
  Top 0.5: FB1.2 C16.1
  other vias: 12.1,5.5 11.7,4.2 10.9,3 10.9,4.2 10.9,5.5 10.9,7.2 11.5,6.3
  pour Bottom (no thermals): 13.1,2.4 11,2.4 10.6,2.8 10.6,7.5 13.1,7.5
  pour Top: 13.1,2.3 16.8,2.3 17,2.5 17,5.9 17.8,6.7 17.8,8.5 18.1,8.8 19.5,8.8 19.5,6.31 18.8,5.81 18.88,2.68 17.92,1.72 13,1.8 12.6,2.2 11.36,2.2 10.6,2.96 10.6,7.5 13.1,7.5
VDD_P3V3  (via drill 0.3 pad 0.45, 0.3 pad 0.6)
  Top 0.2: U1.P$25 16.7,30.91 C8.1 16.63,31.07 v16.07,31.62 | U1.P$9 13.2,23.82 arc-90 C5.1 | C9.1 10.75,30.59 11.6,29.74 U1.P$32 | LD1.1 2.83,23.33 v3.15,23.65
  Top 0.3: R8.2 22.65,17.3 22.47,17.3 21.68,16.5 C20.1 C21.1 20.15,16.65 19.1,16.65 | 19.1,16.65 U4.4 | 7.55,14.5 U2.5 | v20,19.9 19.64,19.55 19.64,17.22 19.1,16.68 19.1,16.65
  Top 0.5: v11.95,30.49 11.75,30.69 C9.1 | C5.1 13.03,23.59 v12.15,23.59 12.15,22.2 9.82,19.88 | 7.55,14.5 C19.1 5.8,14.5 4.8,13.5 4.8,12.3 3V3.1 | U2.5 v7.65,17.67 7.65,17.7 9.82,19.88 | R6.2 v20,19.9 | R7.2 15.12,19.88 v14.27,19.88 9.82,19.88
  Bottom 0.5: v12.15,23.59 11.95,23.79 v11.95,30.49 12.46,31 15.46,31 v16.07,31.62 | P1.4 20.6,20.5 v20,19.9 19.98,19.88 v14.27,19.88 | v3.15,23.65 5.35,23.65 6.15,22.85 6.15,19.17 v7.65,17.67
  Bottom 0.6: v2.4,10.6 3V3.1 v3.8,10.6
  other vias: 3.1,10.6
X1
  Top 0.15: X1.1 20.57,32.19 20.05,31.66 20.05,30.52 19.82,30.29 18.52,30.29 18.05,29.82 18.05,28.84 17.75,28.54 U1.P$23
  Top 0.2: X1.1 20.79,32.21 C1.1

### Text on the board
tPlace: c
tNames: IO | CLK | SCL | SDA | Vdd | GND | SWD | AIN2 | AIN3 | P0.6 | Armature Joint v1.1 | RESET | P0.9 | P0.10 | 3V3 | GND | C18 | - | Design by | F. Stilwell | + | BAT